# Altium schematic sheet 4_SENSORS.SchDoc: SmartHalo - Sensors
size B; Author: Sébastien Gélinas; Organization: SmartHalo; Address1: 5445 de Gaspé; Address2: Montréal, QC; Address3: Canada; Address4: H2T 3B2; DocumentNumber: 2; Revision: 1; SheetNumber: 4; SheetTotal: 7
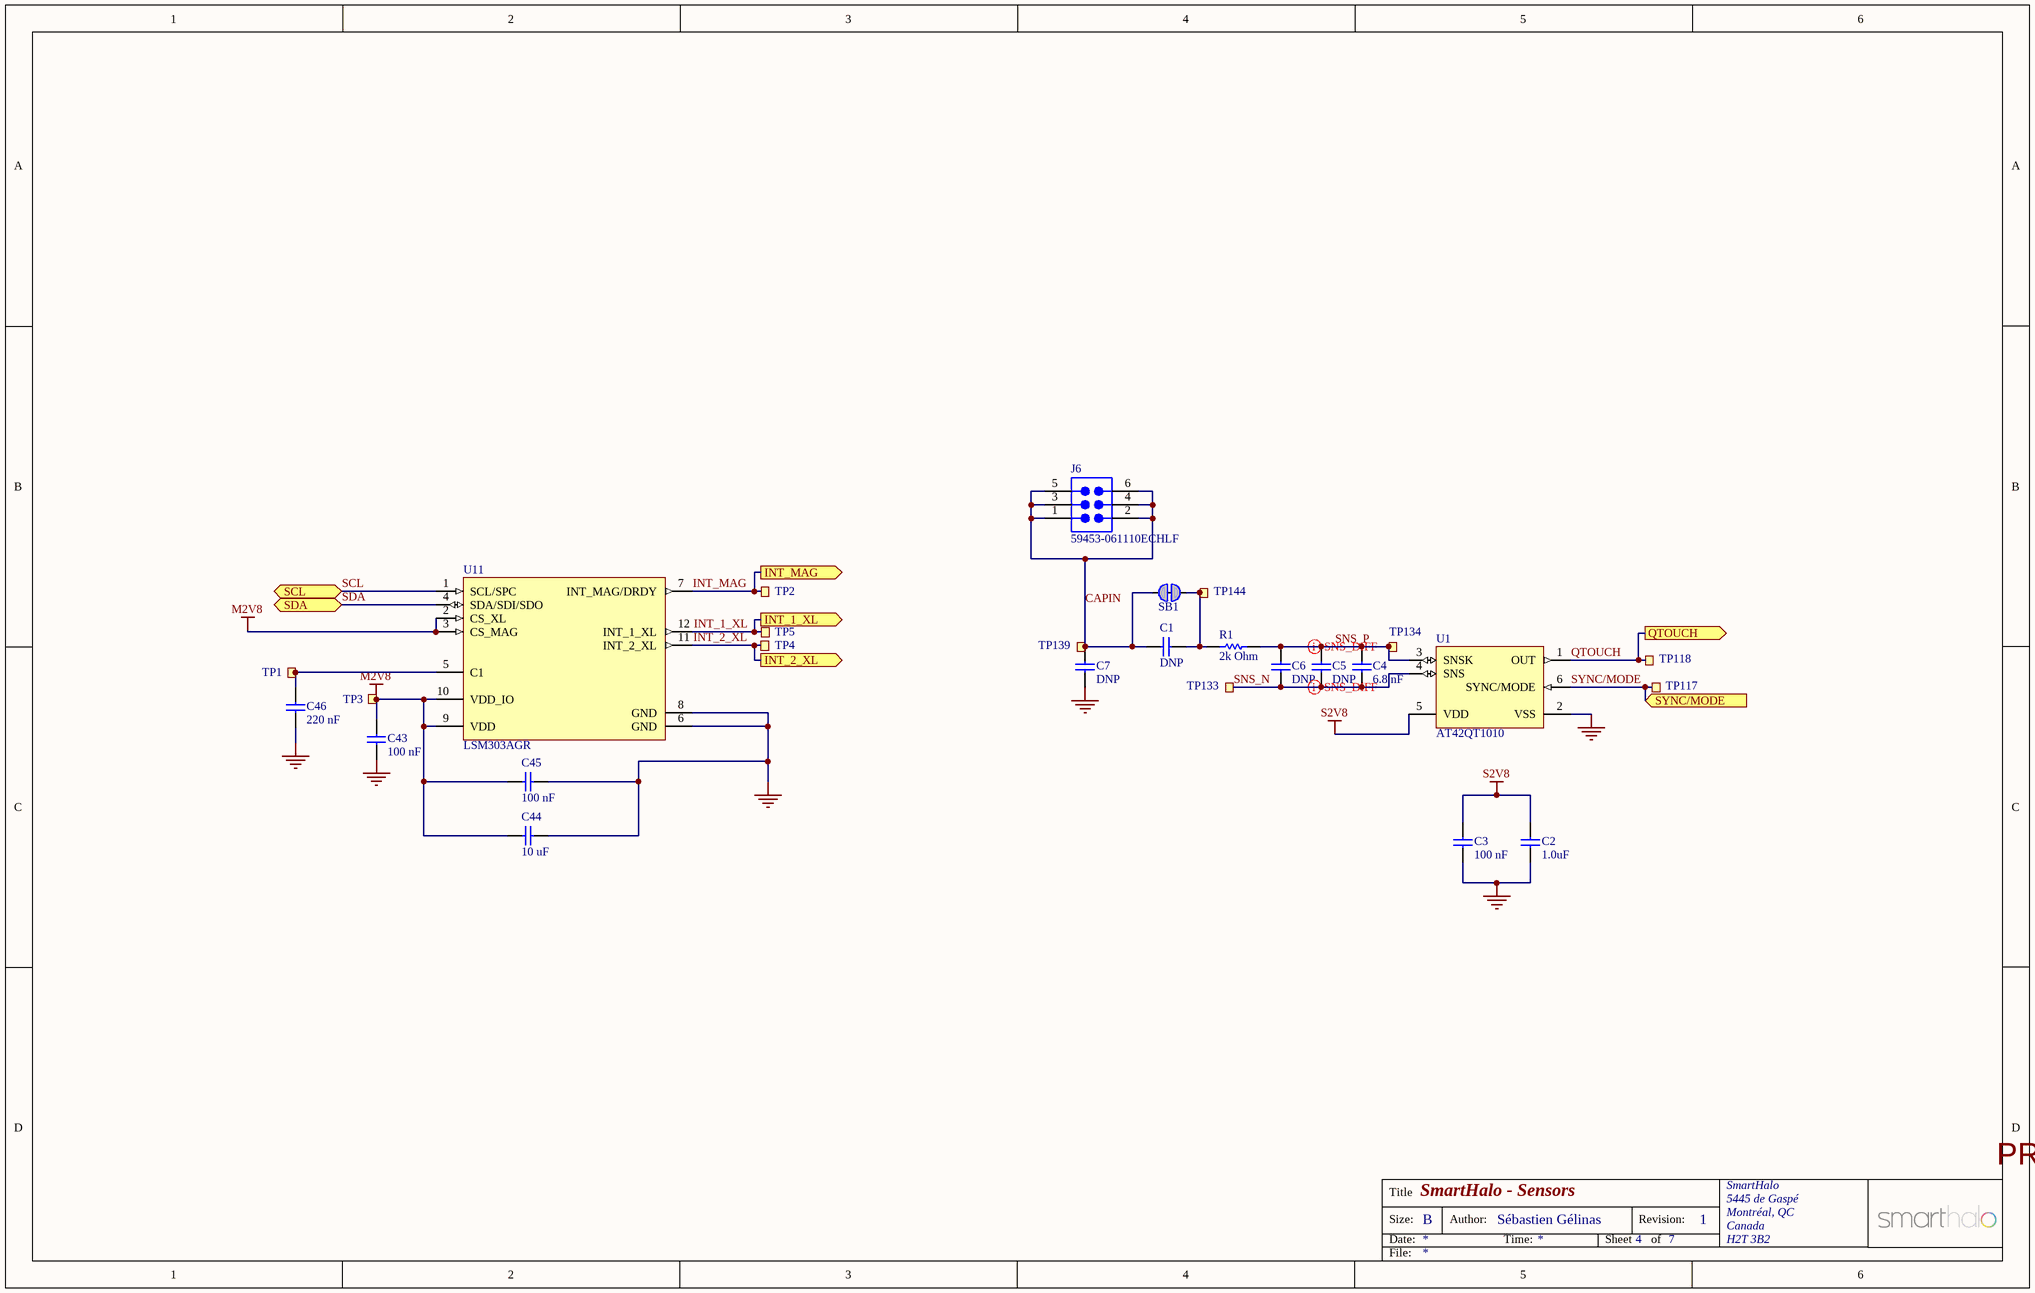
[diagram p0: 4_SENSORS.SchDoc]

## Parts
C1  DNP  [Varitron_CAP0402]  (no BOM)
C2  1.0uF  [Varitron_CAP0603]
C3  100 nF  [Varitron_CAP0402]
C4  6.8 nF  [Varitron_CAP0402]
C5  DNP  [Varitron_CAP0402]  (no BOM)
C6  DNP  [Varitron_CAP0402]  (no BOM)
C7  DNP  [Varitron_CAP0402]  (no BOM)
C43  100 nF  [Varitron_CAP0402]
C44  10 uF  [Varitron_CAP0805]
C45  100 nF  [Varitron_CAP0402]
C46  220 nF  [Varitron_CAP0402]
J6  59453-061110ECHLF  [59453061110ECHLF]
R1  2k Ohm  [Varitron_RES0402]
SB1  Solderbridge  [Solderbridge_Shorted]  (value not drawn)  (net tie, no BOM)
TP1  (no value)  [TESTPAD-TH-35mils]  (no BOM)
TP2  (no value)  [TESTPAD-TH-35mils]  (no BOM)
TP3  (no value)  [TESTPAD-TH-35mils]  (no BOM)
TP4  (no value)  [TESTPAD-TH-35mils]  (no BOM)
TP5  (no value)  [TESTPAD-TH-35mils]  (no BOM)
TP117  (no value)  [TESTPAD-TH-35mils]  (no BOM)
TP118  (no value)  [TESTPAD-TH-1_5mm]  (no BOM)
TP133  (no value)  [TESTPAD-TH-35mils]  (no BOM)
TP134  (no value)  [TESTPAD-TH-35mils]  (no BOM)
TP139  (no value)  [TESTPAD-TH-35mils]  (no BOM)
TP144  (no value)  [TESTPAD-TH-35mils]  (no BOM)
U1  AT42QT1010  [6ST1_N]
U11  LSM303AGR  [LGA12-2X2X1_N]

## Ports
INT_1_XL (out), INT_2_XL (out), INT_MAG (out), QTOUCH (out), SCL (bidir), SDA (bidir), SYNC/MODE (in)

## Nets
GND: C2.2 C3.2 C7.2 C43.2 C44.2 C45.2 C46.2 J6.0(ASSY) U1.2(VSS) U11.6(GND) U11.8(GND)
M2V8: C43.1 C44.1 C45.1 TP3.1 U11.2(CS_XL) U11.3(CS_MAG) U11.9(VDD) U11.10(VDD_IO)
S2V8: C2.1 C3.1 U1.5(VDD)
CAPIN: C1.1 C7.1 J6.1 J6.2 J6.3 J6.4 J6.5 J6.6 SB1.2 TP139.1
INT_1_XL: TP5.1 U11.12(INT_1_XL) ; port INT_1_XL
INT_2_XL: TP4.1 U11.11(INT_2_XL) ; port INT_2_XL
INT_MAG: TP2.1 U11.7(INT_MAG/DRDY) ; port INT_MAG
QTOUCH: TP118.1 U1.1(OUT) ; port QTOUCH
SCL: U11.1(SCL/SPC) ; port SCL
SDA: U11.4(SDA/SDI/SDO) ; port SDA
SNS_N: C4.2 C5.2 C6.2 TP133.1 U1.4(SNS)
SNS_P: C4.1 C5.1 C6.1 R1.1 TP134.1 U1.3(SNSK)
SYNC/MODE: TP117.1 U1.6(SYNC/MODE) ; port SYNC/MODE
NetC1_2: C1.2 R1.2 SB1.1 TP144.1
NetC46_1: C46.1 TP1.1 U11.5(C1)

## Layout directives
differential pair: SNS_N, SNS_P

## Notes on the sheet
- PRELIMINARY: DO NOT USE FOR PRODUCTION
- Title
- Size:
- Date:
- B
- Author:
- Time:
- Sheet
- Revision:
- of
- File:

## Library data of the parts
C1 C5-C7 = Varitron_CAP0402: C nF V TEMP TOL% 0402 (1005 Metric)  SMD; Case-EIA: 0402; Case-Metric: 1005; Tolerance: TOL; Value: C nF; Technology: SMT
C2 = Varitron_CAP0603: 1uF 10V X7R 10% 0603 (1608 Metric)  SMD; Case-EIA: 0603; Case-Metric: 1608; Tolerance: 10%; Technology: SMT; Temperature Coefficient: X7R; Voltage Rating: 10V; Value: 1.0uF
C3 C43 C45 = Varitron_CAP0402: 100 nF 10V X7R 10% 0402 (1005 Metric)  SMD; Case-EIA: 0402; Case-Metric: 1005; Tolerance: 10%; Technology: SMT; Temperature Coefficient: X7R; Voltage Rating: 10V; Value: 100 nF
C4 = Varitron_CAP0402: 6.8 nF 6V X7R 5% 0402 (1005 Metric)  SMD; Case-EIA: 0402; Case-Metric: 1005; Tolerance: 5%; Technology: SMT; Temperature Coefficient: X7R; Voltage Rating: 6V; Value: 6.8 nF
C44 = Varitron_CAP0805: 10 uF 10V X7R 10% 0805 (2012 Metric)  SMD; Case-EIA: 0805; Case-Metric: 2012; Tolerance: 10%; Technology: SMT; Temperature Coefficient: X7R; Voltage Rating: 10V; Value: 10 uF
C46 = Varitron_CAP0402: 220 nF 10V X7R 10% 0402 (1005 Metric)  SMD; Case-EIA: 0402; Case-Metric: 1005; Tolerance: 10%; Technology: SMT; Temperature Coefficient: X7R; Voltage Rating: 10V; Value: 220 nF
J6 = 59453-061110ECHLF: Connector, FPC, 0.5 mm pitch, 6 contacts; Manufacturer: FCI; Manufacturer Part Number: 59453-061110ECHLF; Part Number: 59453-061110ECHLF
R1 = Varitron_RES0402: 2K 0.063W 5%  0402 (1005 Metric)  SMD; Case-Metric: 1005; Case-EIA: 0402; Tolerance: 5%; Technology: SMT; Power: 0.063W; Value: 2k Ohm
SB1 = SOLDERBRIDGE_SHORTED: Shorted Solderbridge; Value: Solderbridge
TP1-TP5 TP117 TP133 TP134 TP139 TP144 = TESTPAD_TH_35mils: Testpoint, through hole, 35 mils; Value: TP
TP118 = TESTPAD_TH_1_5MM: Testpoint, through hole, 1.5mm; Value: TP
U1 = AT42QT1010: One-channel Touch Sensor IC with Reset Timer, -40° to +85° C, 6-pin SOT23; Manufacturer: Atmel; Manufacturer Part Number: AT42QT1010; Part Number: AT42QT1010; Supplier: Arrow Electronics; Footprint Name: SOT23-6
U11 = LSM303AGR: IC 3D Accelerometer and 3D Magnetometer, LGA-12, 2 x 2 x 1 mm; Manufacturer: STMicroelectronics; Manufacturer Part Number: LSM303AGR